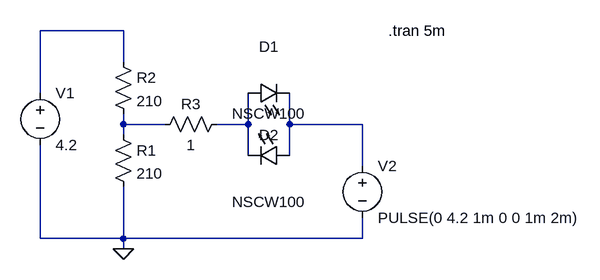
[diagram p0: schematic led.asc]
led.asc, the LTspice schematic file:
Version 4
SHEET 1 996 680
WIRE 288 160 160 160
WIRE 288 208 288 160
WIRE 160 256 160 160
WIRE 288 304 288 288
WIRE 352 304 288 304
WIRE 480 304 480 256
WIRE 480 304 432 304
WIRE 544 304 544 256
WIRE 656 304 544 304
WIRE 288 320 288 304
WIRE 480 352 480 304
WIRE 544 352 544 304
WIRE 656 368 656 304
WIRE 160 480 160 336
WIRE 288 480 288 400
WIRE 288 480 160 480
WIRE 656 480 656 448
WIRE 656 480 288 480
WIRE 288 496 288 480
FLAG 288 496 0
SYMBOL res 272 304 R0
SYMATTR InstName R1
SYMATTR Value 210
SYMBOL res 272 192 R0
SYMATTR InstName R2
SYMATTR Value 210
SYMBOL voltage 160 240 R0
SYMATTR InstName V1
SYMATTR Value 4.2
SYMBOL LED 480 272 R270
WINDOW 0 72 32 VTop 2
WINDOW 3 0 32 VBottom 2
SYMATTR InstName D1
SYMATTR Value NSCW100
SYMBOL LED 544 336 R90
WINDOW 0 0 32 VBottom 2
WINDOW 3 72 32 VTop 2
SYMATTR InstName D2
SYMATTR Value NSCW100
SYMBOL voltage 656 352 R0
SYMATTR InstName V2
SYMATTR Value PULSE(0 4.2 1m 0 0 1m 2m)
SYMBOL res 448 288 R90
WINDOW 0 0 56 VBottom 2
WINDOW 3 32 56 VTop 2
SYMATTR InstName R3
SYMATTR Value 1
TEXT 696 160 Left 2 !.tran 5m

The netlist it stands for:
* led.asc
R1 N002 0 210
R2 N001 N002 210
V1 N001 0 4.2
D1 N003 N004 NSCW100
D2 N004 N003 NSCW100
V2 N004 0 PULSE(0 4.2 1m 0 0 1m 2m)
R3 N003 N002 1
.model D D
.lib standard.dio
.tran 5m
.backanno
.end